# EAGLE schematic TiLDA Mk2 Prototype v0.1 (EAGLE 6.1)
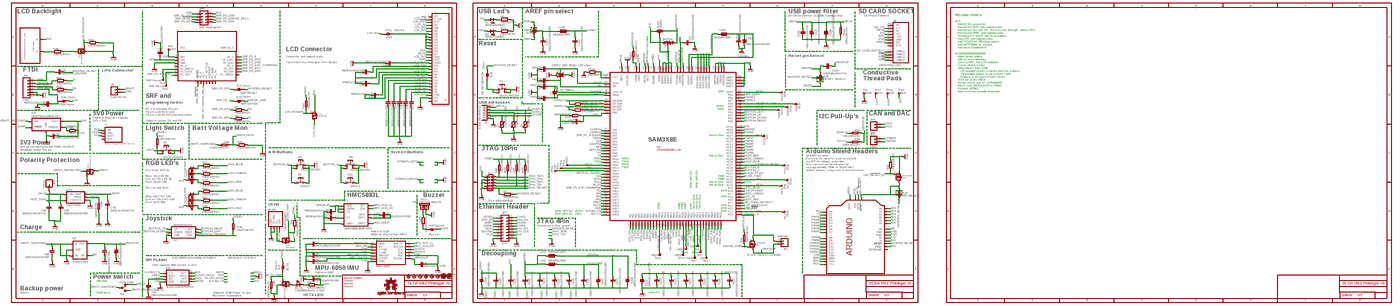
[diagram p0: schematic, sheet 1, overview]
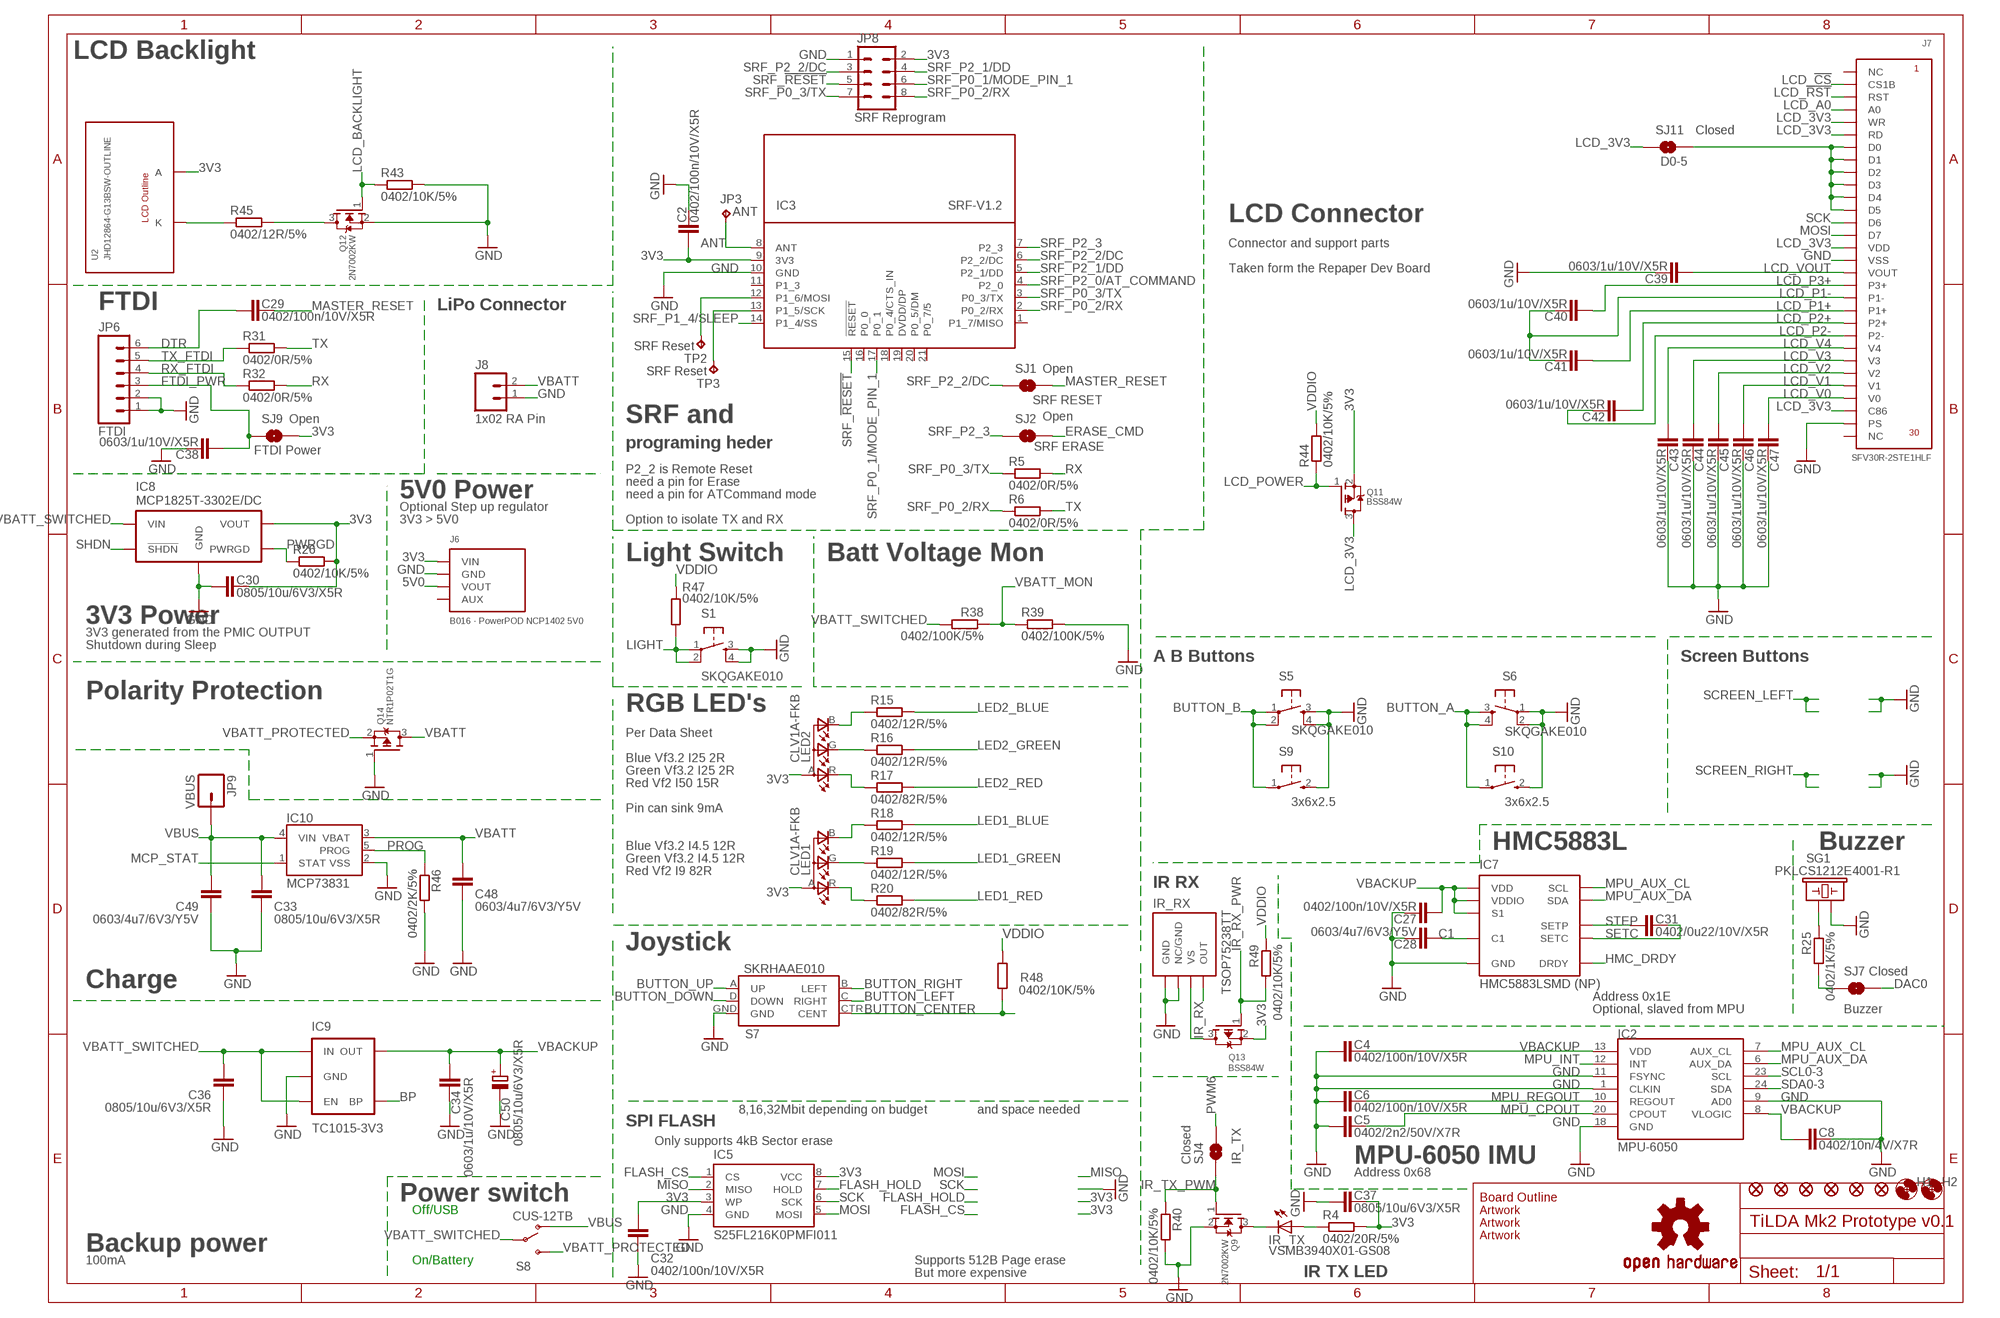
[diagram p1: schematic, sheet 1, part 1 of 4]
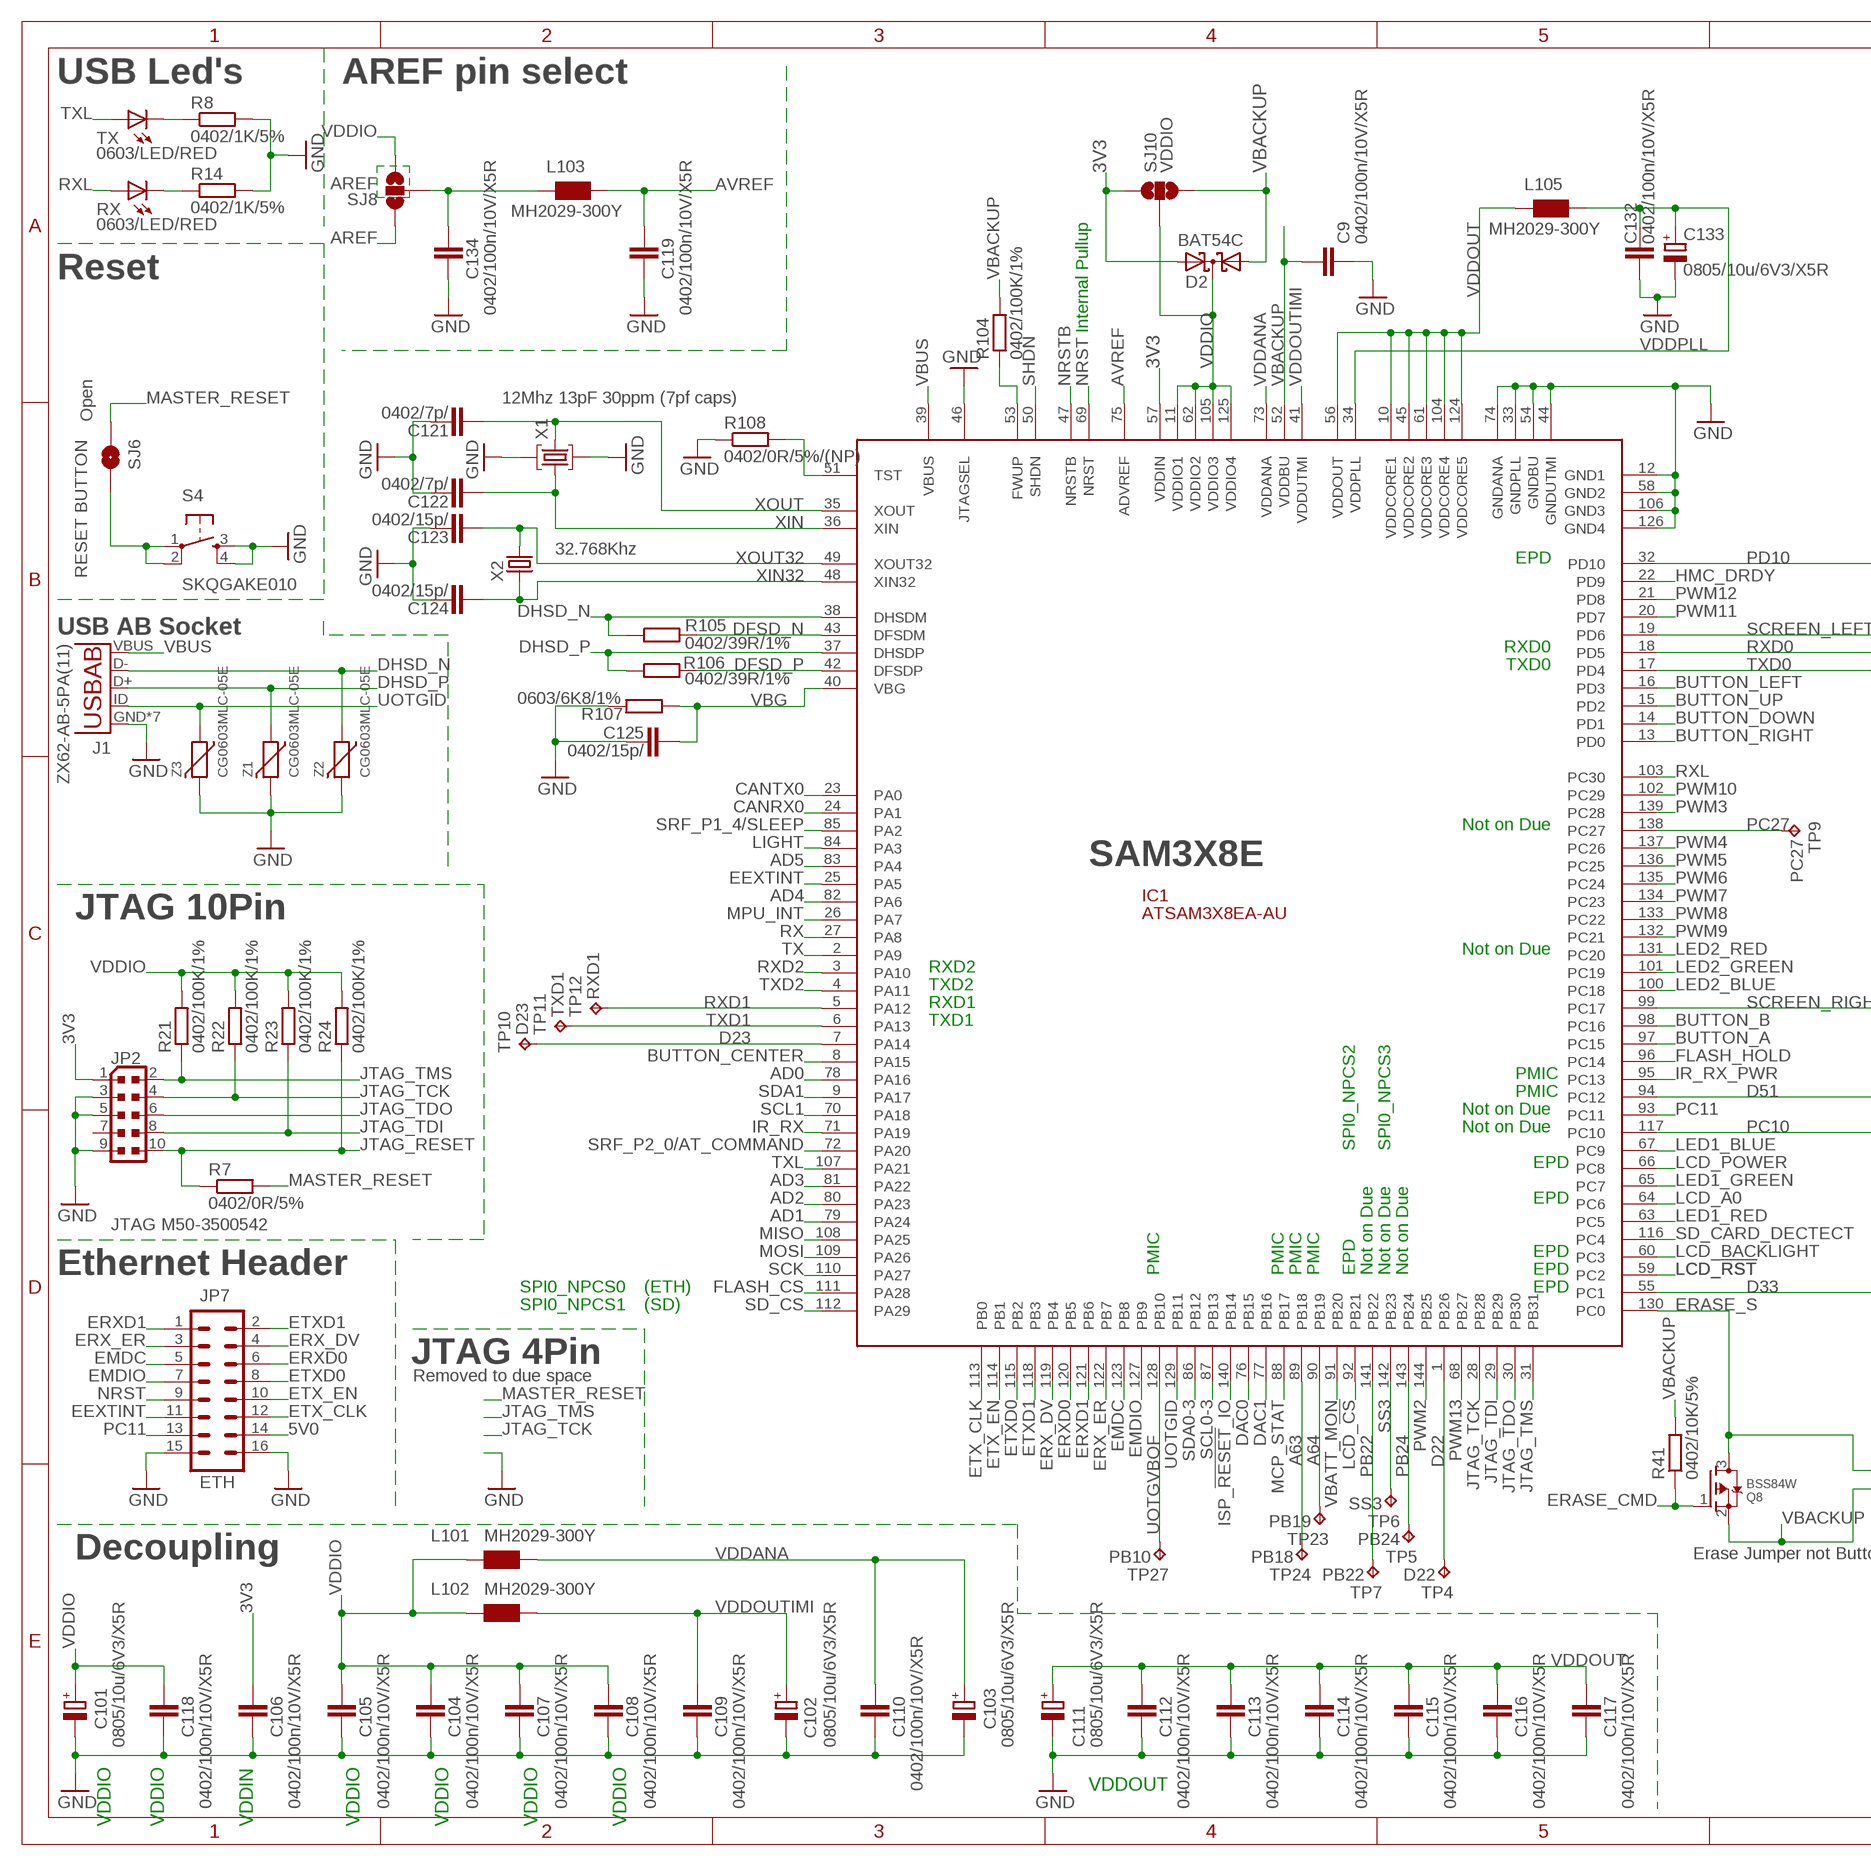
[diagram p2: schematic, sheet 1, part 2 of 4]
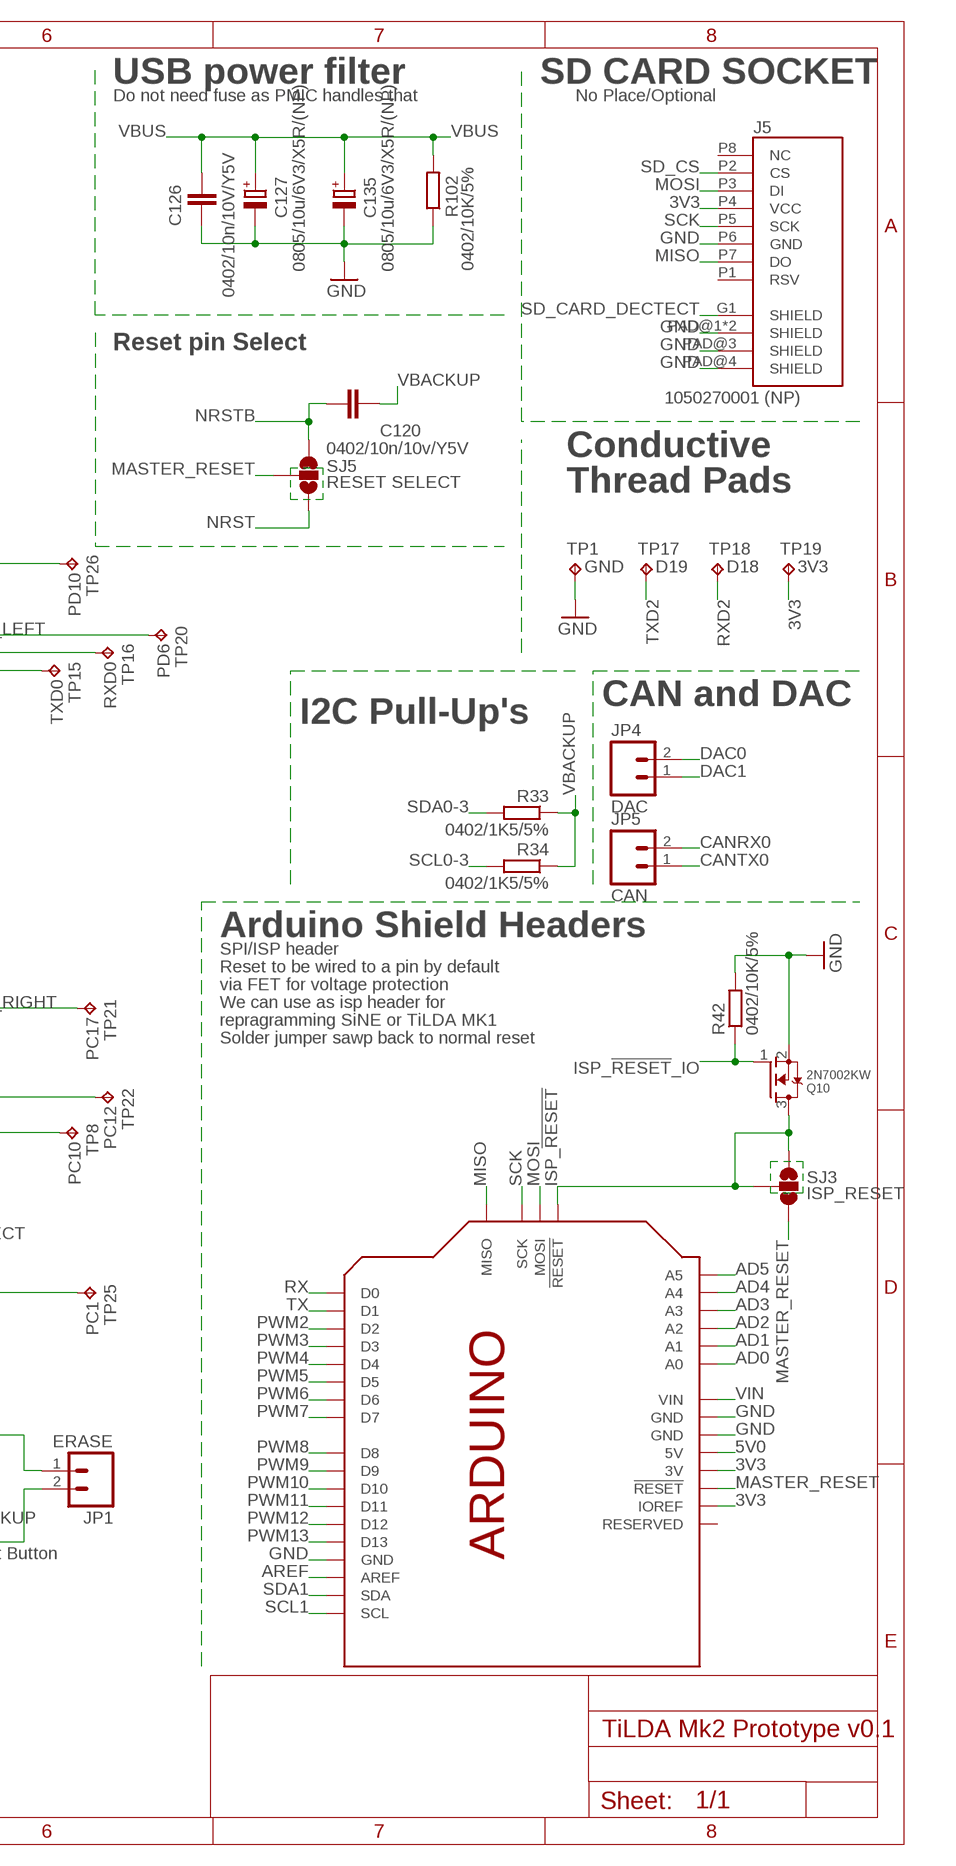
[diagram p3: schematic, sheet 1, part 3 of 4]
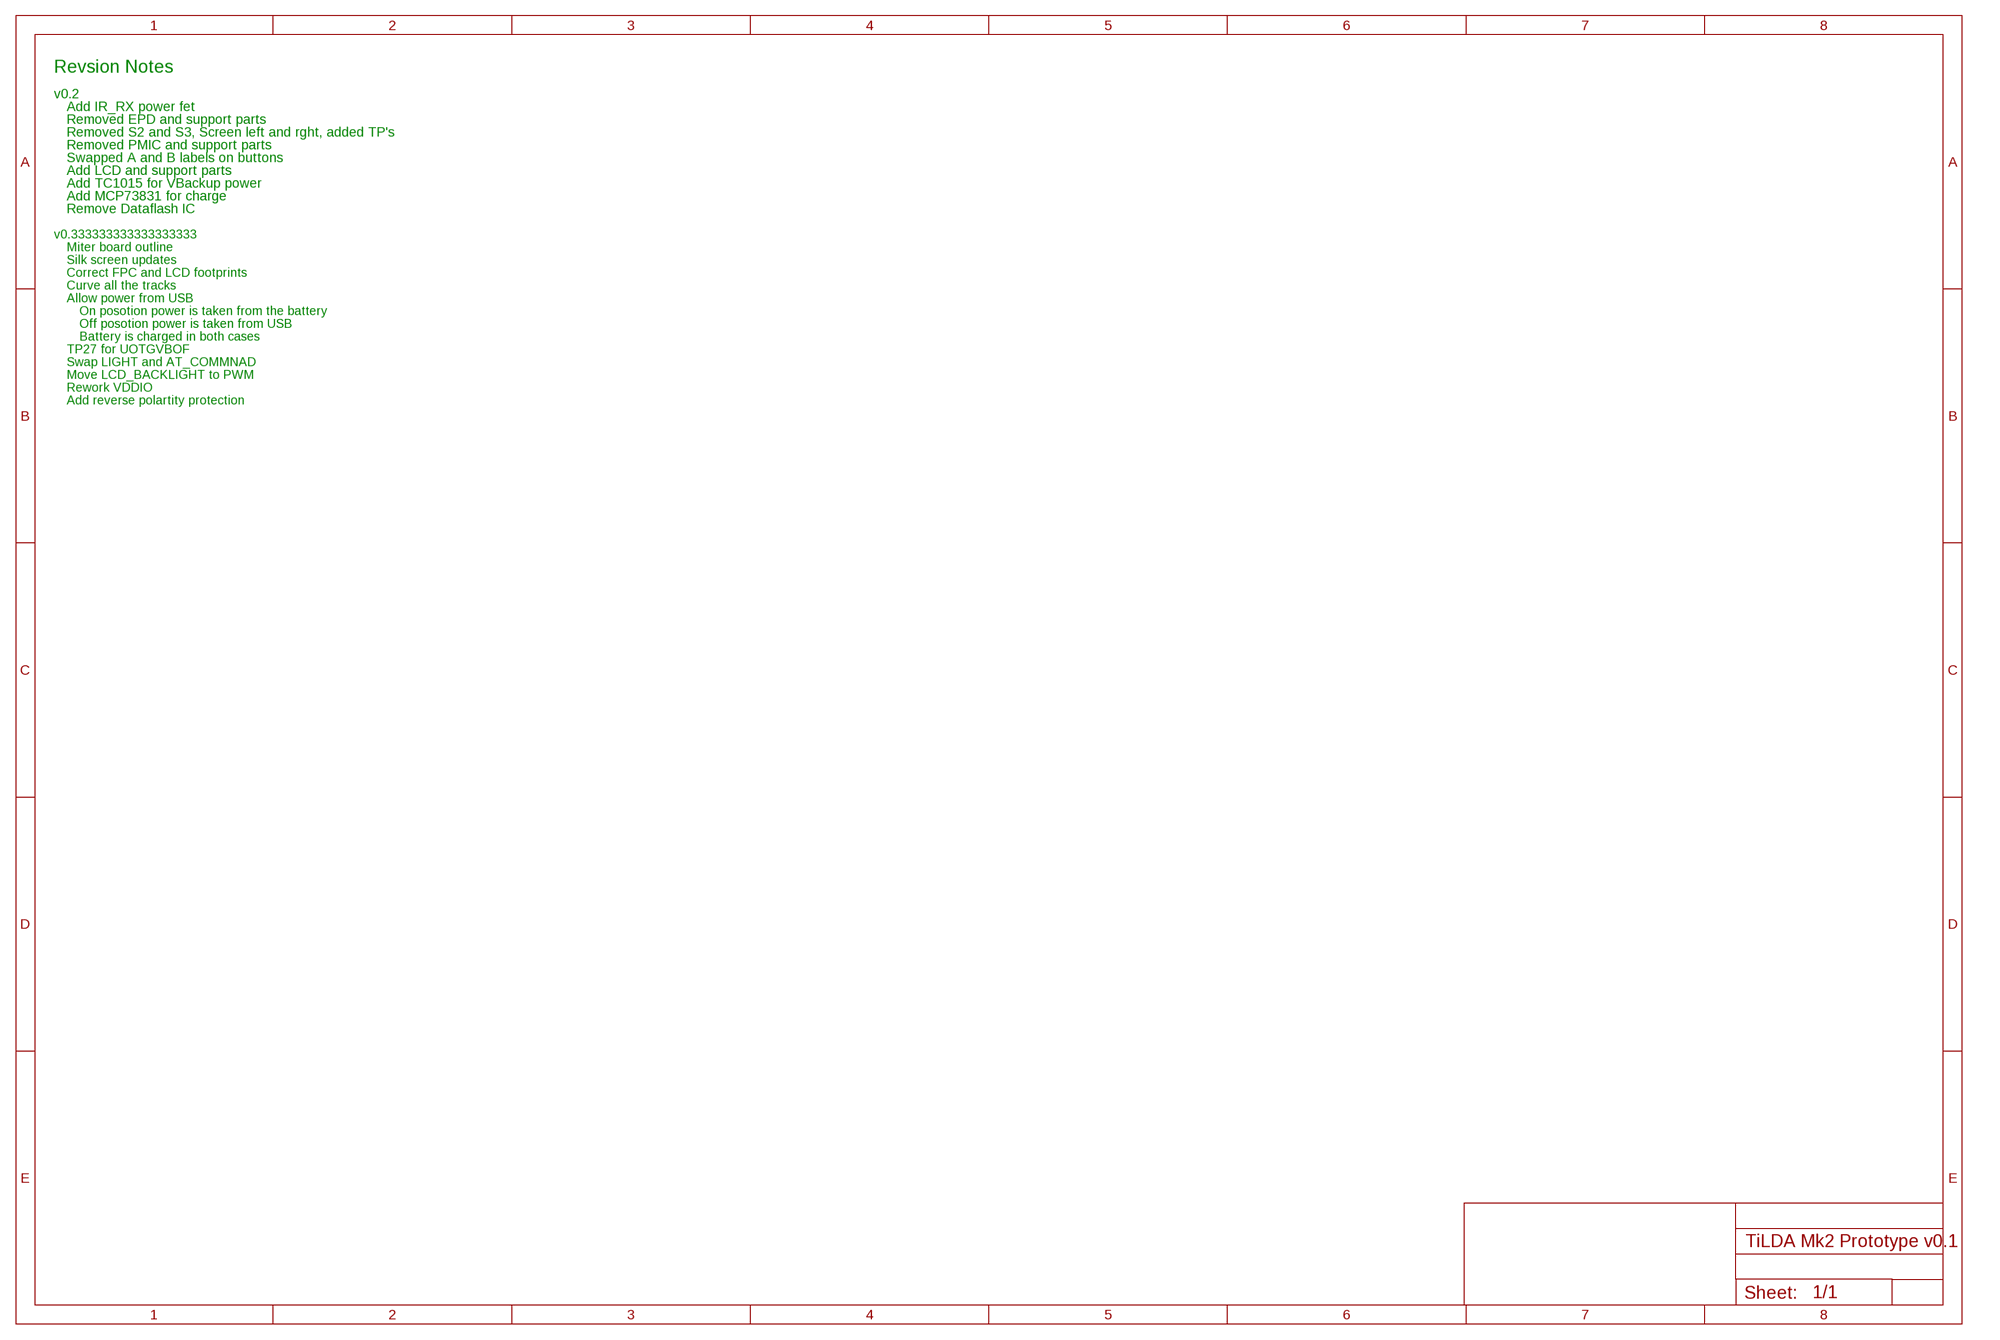
[diagram p4: schematic, sheet 1, part 4 of 4]

## Parts
ARTWORK1  ARTWORK_FRONT1  [TILDA_ARTWORK_FRONT1]
ARTWORK2  ARTWORK_ACHIEVEMENT2  [TILDA_ARTWORK_ACHIEVEMENT2]
ARTWORK3  ARTWORK_ACHIEVEMENT3  [TILDA_ARTWORK_ACHIEVEMENT3]
C2  0402/100n/10V/X5R  C-EUC0402-ARDUINO-ROUND  [C0402-ARDUINO-ROUND]
C4  0402/100n/10V/X5R  C-EUC0402-ARDUINO-ROUND  [C0402-ARDUINO-ROUND]
C5  0402/2n2/50V/X7R  C-EUC0402-ARDUINO-ROUND  [C0402-ARDUINO-ROUND]
C6  0402/100n/10V/X5R  C-EUC0402-ARDUINO-ROUND  [C0402-ARDUINO-ROUND]
C8  0402/10n/4V/X7R  C-EUC0402-ARDUINO-ROUND  [C0402-ARDUINO-ROUND]
C9  0402/100n/10V/X5R  C-EUC0402-ARDUINO-ROUND  [C0402-ARDUINO-ROUND]
C27  0402/100n/10V/X5R  C-EUC0402-ARDUINO-ROUND  [C0402-ARDUINO-ROUND]
C28  0603/4u7/6V3/Y5V  C-EUC0603-ROUND  [C0603-ROUND]
C29  0402/100n/10V/X5R  C-EUC0402-ARDUINO-ROUND  [C0402-ARDUINO-ROUND]
C30  0805/10u/6V3/X5R  C-EUC0805RND  [C0805RND]
C31  0402/0u22/10V/X5R  C-EUC0402-ARDUINO-ROUND  [C0402-ARDUINO-ROUND]
C32  0402/100n/10V/X5R  C-EUC0402-ARDUINO-ROUND  [C0402-ARDUINO-ROUND]
C33  0805/10u/6V3/X5R  C-EUC0805RND  [C0805RND]
C34  0603/1u/10V/X5R  C-EUC0603-ROUND  [C0603-ROUND]
C36  0805/10u/6V3/X5R  C-EUC0805RND  [C0805RND]
C37  0805/10u/6V3/X5R  C-EUC0805RND  [C0805RND]
C38  0603/1u/10V/X5R  C-EUC0603-ROUND  [C0603-ROUND]
C39  0603/1u/10V/X5R  C-EUC0603-ROUND  [C0603-ROUND]
C40  0603/1u/10V/X5R  C-EUC0603-ROUND  [C0603-ROUND]
C41  0603/1u/10V/X5R  C-EUC0603-ROUND  [C0603-ROUND]
C42  0603/1u/10V/X5R  C-EUC0603-ROUND  [C0603-ROUND]
C43  0603/1u/10V/X5R  C-EUC0603-ROUND  [C0603-ROUND]
C44  0603/1u/10V/X5R  C-EUC0603-ROUND  [C0603-ROUND]
C45  0603/1u/10V/X5R  C-EUC0603-ROUND  [C0603-ROUND]
C46  0603/1u/10V/X5R  C-EUC0603-ROUND  [C0603-ROUND]
C47  0603/1u/10V/X5R  C-EUC0603-ROUND  [C0603-ROUND]
C48  0603/4u7/6V3/Y5V  C-EUC0603-ROUND  [C0603-ROUND]
C49  0603/4u7/6V3/Y5V  C-EUC0603-ROUND  [C0603-ROUND]
C50  0805/10u/6V3/X5R  CPOL-EU-C0805RNDPOL  [C0805RNDPOL]
C101  0805/10u/6V3/X5R  CPOL-EU-C0805RNDPOL  [C0805RNDPOL]
C102  0805/10u/6V3/X5R  CPOL-EU-C0805RNDPOL  [C0805RNDPOL]
C103  0805/10u/6V3/X5R  CPOL-EU-C0805RNDPOL  [C0805RNDPOL]
C104  0402/100n/10V/X5R  C-EUC0402-ARDUINO-ROUND  [C0402-ARDUINO-ROUND]
C105  0402/100n/10V/X5R  C-EUC0402-ARDUINO-ROUND  [C0402-ARDUINO-ROUND]
C106  0402/100n/10V/X5R  C-EUC0402-ARDUINO-ROUND  [C0402-ARDUINO-ROUND]
C107  0402/100n/10V/X5R  C-EUC0402-ARDUINO-ROUND  [C0402-ARDUINO-ROUND]
C108  0402/100n/10V/X5R  C-EUC0402-ARDUINO-ROUND  [C0402-ARDUINO-ROUND]
C109  0402/100n/10V/X5R  C-EUC0402-ARDUINO-ROUND  [C0402-ARDUINO-ROUND]
C110  0402/100n/10V/X5R  C-EUC0402-ARDUINO-ROUND  [C0402-ARDUINO-ROUND]
C111  0805/10u/6V3/X5R  CPOL-EU-C0805RNDPOL  [C0805RNDPOL]
C112  0402/100n/10V/X5R  C-EUC0402-ARDUINO-ROUND  [C0402-ARDUINO-ROUND]
C113  0402/100n/10V/X5R  C-EUC0402-ARDUINO-ROUND  [C0402-ARDUINO-ROUND]
C114  0402/100n/10V/X5R  C-EUC0402-ARDUINO-ROUND  [C0402-ARDUINO-ROUND]
C115  0402/100n/10V/X5R  C-EUC0402-ARDUINO-ROUND  [C0402-ARDUINO-ROUND]
C116  0402/100n/10V/X5R  C-EUC0402-ARDUINO-ROUND  [C0402-ARDUINO-ROUND]
C117  0402/100n/10V/X5R  C-EUC0402-ARDUINO-ROUND  [C0402-ARDUINO-ROUND]
C118  0402/100n/10V/X5R  C-EUC0402-ARDUINO-ROUND  [C0402-ARDUINO-ROUND]
C119  0402/100n/10V/X5R  C-EUC0402-ARDUINO-ROUND  [C0402-ARDUINO-ROUND]
C120  0402/10n/10v/Y5V  C-EUC0402-ARDUINO-ROUND  [C0402-ARDUINO-ROUND]
C121  0402/7p/  C-EUC0402-ARDUINO-ROUND  [C0402-ARDUINO-ROUND]
C122  0402/7p/  C-EUC0402-ARDUINO-ROUND  [C0402-ARDUINO-ROUND]
C123  0402/15p/  C-EUC0402-ARDUINO-ROUND  [C0402-ARDUINO-ROUND]
C124  0402/15p/  C-EUC0402-ARDUINO-ROUND  [C0402-ARDUINO-ROUND]
C125  0402/15p/  C-EUC0402-ARDUINO-ROUND  [C0402-ARDUINO-ROUND]
C126  0402/10n/10V/Y5V  C-EUC0402-ARDUINO-ROUND  [C0402-ARDUINO-ROUND]
C127  0805/10u/6V3/X5R/(NP)  CPOL-EU-C0805RNDPOL  [C0805RNDPOL]
C132  0402/100n/10V/X5R  C-EUC0402-ARDUINO-ROUND  [C0402-ARDUINO-ROUND]
C133  0805/10u/6V3/X5R  CPOL-EU-C0805RNDPOL  [C0805RNDPOL]
C134  0402/100n/10V/X5R  C-EUC0402-ARDUINO-ROUND  [C0402-ARDUINO-ROUND]
C135  0805/10u/6V3/X5R/(NP)  CPOL-EU-C0805RNDPOL  [C0805RNDPOL]
D2  BAT54C  [SOT23]
FID1  FIDUCIAL1X2.5-STOP  [FIDUCIAL-1X2.5-STOP]
FID2  FIDUCIAL1X2.5-STOP  [FIDUCIAL-1X2.5-STOP]
FID3  FIDUCIAL1X2.5-STOP  [FIDUCIAL-1X2.5-STOP]
FID4  FIDUCIAL1X2.5-STOP  [FIDUCIAL-1X2.5-STOP]
FID5  FIDUCIAL1X2.5-STOP  [FIDUCIAL-1X2.5-STOP]
FID6  FIDUCIAL1X2.5-STOP  [FIDUCIAL-1X2.5-STOP]
H1  MOUNT-HOLE4.5-LWK  [4,5-LWK]
H2  MOUNT-HOLE4.5-LWK  [4,5-LWK]
IC1  ATSAM3X8EA-AU  ATSAM3X/AAU  [LQFP144]
IC2  MPU-6050  [QFN-24-NODIE]
IC3  SRF-V1.2  SRF-LANDING-1.2  [SRF-LANDING-1.2]
IC5  S25FL216K0PMFI011  SPI_FLASH-X25XXSMD1  [SO08-EIAJ]
IC7  HMC5883LSMD (NP)  HMC5883LSMD  [16LPCC]
IC8  MCP1825T-3302E/DC  [SOT127P700X180-6N]
IC9  TC1015-3V3  V_REG_LDOSMD  [SOT23-5]
IC10  MCP73831  [SOT23-5]
IR_RX  TSOP75238TT  IR-RECEIVERTSOP75438TT  [TSOP75X]
IR_TX  VSMB3940X01-GS08  IR-SENDER-PLCC  [P-LCC-2]
J1  ZX62-AB-5PA(11)  USB-AB-LWK  [USB-AB-MICRO-SMD_LWK]
J3  Arduino Headers  ARDUINOSPI-REFRENCE  [ARDUINOR3-LWKTXT-REF-SPI]
J5  1050270001 (NP)  USD-SOCKET-105027-LWK  [105027-LWK]
J6  B016 - PowerPOD NCP1402 5V0  POWER-POD-EMF  [POWER-POD-EMF]
J7  SFV30R-2STE1HLF  JHD12863-G13BSW-CONNECTOR-SFV30R-2STE1HLF  [SFV30R-2STE1HLF]
J8  1x02 RA Pin  M02RA  [1X02_RA]
JP1  ERASE  M02PTH  [1X02]
JP2  JTAG M50-3500542  PINHEAD_PINHD-2X5PASSO127  [PINHEAD_2X05_127]
JP3  ANT  TPPAD1-13  [P1-13]
JP4  DAC  M021X02_NO_SILK_OCT  [1X02_NO_SILK_OCT]
JP5  CAN  M021X02_NO_SILK_OCT  [1X02_NO_SILK_OCT]
JP6  FTDI  M06SIP  [1X06]
JP7  ETH  M08X2  [2X8]
JP8  SRF Reprogram  M04X2-PAD  [2X4-PAD]
JP9  VBUS  M01PTH  [1X01]
L101  MH2029-300Y  WE-CBF_0805  [WUERTH-0805]
L102  MH2029-300Y  WE-CBF_0805  [WUERTH-0805]
L103  MH2029-300Y  WE-CBF_0805  [WUERTH-0805]
L105  MH2029-300Y  WE-CBF_0805  [WUERTH-0805]
LED1  CLV1A-FKB  LED-RGB_CLV1A-FKB  [LED-RGB_CLV1A-FKB]
LED2  CLV1A-FKB  LED-RGB_CLV1A-FKB  [LED-RGB_CLV1A-FKB]
LOGO1  OSHW-LOGOM  [OSHW-LOGO-M]
OUTLINE1  TILDA_BOARDOUTLINE-MITER  [TILDA_BADGEBOARDBARE-VERYWIDE-MITER]
Q8  BSS84W  MOSFET-P-SC70-3  [SC70-3-R]
Q9  2N7002KW  MOSFET-NSC70-3  [SC70-3-R]
Q10  2N7002KW  MOSFET-NSC70-3  [SC70-3-R]
Q11  BSS84W  MOSFET-P-SC70-3  [SC70-3-R]
Q12  2N7002KW  MOSFET-NSC70-3  [SC70-3-R]
Q13  BSS84W  MOSFET-P-SC70-3  [SC70-3-R]
Q14  NTR1P02T1G  MOSFET-P-SOT23  [SOT23-R]
R4  0402/20R/5%  R-EU_R0402-ARDUINO-ROUND  [R0402-ARDUINO-ROUND]
R5  0402/0R/5%  R-EU_R0402-ARDUINO-ROUND  [R0402-ARDUINO-ROUND]
R6  0402/0R/5%  R-EU_R0402-ARDUINO-ROUND  [R0402-ARDUINO-ROUND]
R7  0402/0R/5%  R-EU_R0402-ARDUINO-ROUND  [R0402-ARDUINO-ROUND]
R8  0402/1K/5%  R-EU_R0402-ARDUINO-ROUND  [R0402-ARDUINO-ROUND]
R14  0402/1K/5%  R-EU_R0402-ARDUINO-ROUND  [R0402-ARDUINO-ROUND]
R15  0402/12R/5%  R-EU_R0402-ARDUINO-ROUND  [R0402-ARDUINO-ROUND]
R16  0402/12R/5%  R-EU_R0402-ARDUINO-ROUND  [R0402-ARDUINO-ROUND]
R17  0402/82R/5%  R-EU_R0402-ARDUINO-ROUND  [R0402-ARDUINO-ROUND]
R18  0402/12R/5%  R-EU_R0402-ARDUINO-ROUND  [R0402-ARDUINO-ROUND]
R19  0402/12R/5%  R-EU_R0402-ARDUINO-ROUND  [R0402-ARDUINO-ROUND]
R20  0402/82R/5%  R-EU_R0402-ARDUINO-ROUND  [R0402-ARDUINO-ROUND]
R21  0402/100K/1%  R-EU_R0402-ARDUINO-ROUND  [R0402-ARDUINO-ROUND]
R22  0402/100K/1%  R-EU_R0402-ARDUINO-ROUND  [R0402-ARDUINO-ROUND]
R23  0402/100K/1%  R-EU_R0402-ARDUINO-ROUND  [R0402-ARDUINO-ROUND]
R24  0402/100K/1%  R-EU_R0402-ARDUINO-ROUND  [R0402-ARDUINO-ROUND]
R25  0402/1K/5%  R-EU_R0402-ARDUINO-ROUND  [R0402-ARDUINO-ROUND]
R26  0402/10K/5%  R-EU_R0402-ARDUINO-ROUND  [R0402-ARDUINO-ROUND]
R31  0402/0R/5%  R-EU_R0402-ARDUINO-ROUND  [R0402-ARDUINO-ROUND]
R32  0402/0R/5%  R-EU_R0402-ARDUINO-ROUND  [R0402-ARDUINO-ROUND]
R33  0402/1K5/5%  R-EU_R0402-ARDUINO-ROUND  [R0402-ARDUINO-ROUND]
R34  0402/1K5/5%  R-EU_R0402-ARDUINO-ROUND  [R0402-ARDUINO-ROUND]
R38  0402/100K/5%  R-EU_R0402-ARDUINO-ROUND  [R0402-ARDUINO-ROUND]
R39  0402/100K/5%  R-EU_R0402-ARDUINO-ROUND  [R0402-ARDUINO-ROUND]
R40  0402/10K/5%  R-EU_R0402-ARDUINO-ROUND  [R0402-ARDUINO-ROUND]
R41  0402/10K/5%  R-EU_R0402-ARDUINO-ROUND  [R0402-ARDUINO-ROUND]
R42  0402/10K/5%  R-EU_R0402-ARDUINO-ROUND  [R0402-ARDUINO-ROUND]
R43  0402/10K/5%  R-EU_R0402-ARDUINO-ROUND  [R0402-ARDUINO-ROUND]
R44  0402/10K/5%  R-EU_R0402-ARDUINO-ROUND  [R0402-ARDUINO-ROUND]
R45  0402/12R/5%  R-EU_R0402-ARDUINO-ROUND  [R0402-ARDUINO-ROUND]
R46  0402/2K/5%  R-EU_R0402-ARDUINO-ROUND  [R0402-ARDUINO-ROUND]
R47  0402/10K/5%  R-EU_R0402-ARDUINO-ROUND  [R0402-ARDUINO-ROUND]
R48  0402/10K/5%  R-EU_R0402-ARDUINO-ROUND  [R0402-ARDUINO-ROUND]
R49  0402/10K/5%  R-EU_R0402-ARDUINO-ROUND  [R0402-ARDUINO-ROUND]
R102  0402/10K/5%  R-EU_R0402-ARDUINO-ROUND  [R0402-ARDUINO-ROUND]
R104  0402/100K/1%  R-EU_R0402-ARDUINO-ROUND  [R0402-ARDUINO-ROUND]
R105  0402/39R/1%  R-EU_R0402-ARDUINO-ROUND  [R0402-ARDUINO-ROUND]
R106  0402/39R/1%  R-EU_R0402-ARDUINO-ROUND  [R0402-ARDUINO-ROUND]
R107  0603/6K8/1%  R-EU_R0603-ROUND  [R0603-ROUND]
R108  0402/0R/5%/(NP)  R-EU_R0402-ARDUINO-ROUND  [R0402-ARDUINO-ROUND]
RX  0603/LED/RED  LED0805-CORRECT  [LED-0805-CORRECT]
S1  SKQGAKE010  TAC_SWITCHSMD  [TACTILE_SWITCH_SMD]
S4  SKQGAKE010  TAC_SWITCHSMD  [TACTILE_SWITCH_SMD]
S5  SKQGAKE010  TAC_SWITCHSMD  [TACTILE_SWITCH_SMD]
S6  SKQGAKE010  TAC_SWITCHSMD  [TACTILE_SWITCH_SMD]
S7  SKRHAAE010  JOYSTICK_MINI_MULTICOMP  [JOYSTICK_MULTICOMP]
S8  CUS-12TB  SWITCH-SPST-SMD-A  [SWITCH-SPST-SMD-A]
S9  3x6x2.5  TAC_SWITCH1-3X6X2.5  [TACTILE_SWITCH_SMD_3X6X2.5H]
S10  3x6x2.5  TAC_SWITCH1-3X6X2.5  [TACTILE_SWITCH_SMD_3X6X2.5H]
SG1  PKLCS1212E4001-R1  BUZZER-PKLCS1212E  [BUZZER-PKLCS1212E]
SJ1  SRF RESET  SOLDERJUMPERNO  [SJ_2S-NO]
SJ2  SRF ERASE  SOLDERJUMPERNO  [SJ_2S-NO]
SJ3  ISP_RESET  SOLDERJUMPER_2WAYS  [SJ_3]
SJ4  IR_TX  SOLDERJUMPERTRACE  [SJ_2S-TRACE]
SJ5  RESET SELECT  SOLDERJUMPER_2WAYS  [SJ_3]
SJ6  RESET BUTTON  SOLDERJUMPERNO  [SJ_2S-NO]
SJ7  Buzzer  SOLDERJUMPERTRACE  [SJ_2S-TRACE]
SJ8  AREF  SOLDERJUMPER_2WAYS  [SJ_3]
SJ9  FTDI Power  SOLDERJUMPERNO  [SJ_2S-NO]
SJ10  VDDIO  SOLDERJUMPER_2WAYS  [SJ_3]
SJ11  D0-5  SOLDERJUMPERNO  [SJ_2S-NO]
TP1  GND  TPPAD1-13  [P1-13]
TP2  SRF Reset  TPB1,27  [B1,27]
TP3  SRF Reset  TPB1,27  [B1,27]
TP4  D22  TPB1,27  [B1,27]
TP5  PB24  TPB1,27  [B1,27]
TP6  SS3  TPB1,27  [B1,27]
TP7  PB22  TPB1,27  [B1,27]
TP8  PC10  TPB1,27  [B1,27]
TP9  PC27  TPB1,27  [B1,27]
TP10  D23  TPB1,27  [B1,27]
TP11  TXD1  TPB1,27  [B1,27]
TP12  RXD1  TPB1,27  [B1,27]
TP15  TXD0  TPB1,27  [B1,27]
TP16  RXD0  TPB1,27  [B1,27]
TP17  D19  TPPAD1-13  [P1-13]
TP18  D18  TPPAD1-13  [P1-13]
TP19  3V3  TPPAD1-13  [P1-13]
TP20  PD6  TPB1,27  [B1,27]
TP21  PC17  TPB1,27  [B1,27]
TP22  PC12  TPB1,27  [B1,27]
TP23  PB19  TPB1,27  [B1,27]
TP24  PB18  TPB1,27  [B1,27]
TP25  PC1  TPB1,27  [B1,27]
TP26  PD10  TPB1,27  [B1,27]
TP27  PB10  TPB1,27  [B1,27]
TX  0603/LED/RED  LED0805-CORRECT  [LED-0805-CORRECT]
U2  JHD12864-G13BSW-OUTLINE  [JHD12864-G13BSW-OUTLINE]
X1  12Mhz 13pF 30ppm (7pf caps)  CRYSTAL-5X3.2  [CRYSTAL-5X3.2]
X2  32.768Khz  RESONATOR_EPSON_FC_145  [RESONATOR_EPSON_FC_145]
Z1  CG0603MLC-05E  VARISTORCN0603  [CT/CN0603]
Z2  CG0603MLC-05E  VARISTORCN0603  [CT/CN0603]
Z3  CG0603MLC-05E  VARISTORCN0603  [CT/CN0603]

## Nets
3V3: C2.2 C30.1 C32.2 C37.1 C106.2 D2.2(A2) IC1.57(VDDIN) IC3.9(3V3) IC5.3(WP) IC5.8(VCC) IC8.4(VOUT) J3.3V J3.IOREF J5.P4(VCC) J6.1(VIN) JP2.1 JP8.2 LED1.A(ANODE) LED2.A(ANODE) Q11.2(S) Q13.2(S) R4.2 R26.2 SJ9.2 SJ10.1 TP19.TP U2.A
5V0: J3.5V J3.5V@ISP(5V) J6.3(VOUT) JP7.14
A63: IC1.89(PB18) TP24.TP
A64: IC1.90(PB19) TP23.TP
AD0: IC1.78(PA16) J3.A0
AD1: IC1.79(PA24) J3.A1
AD2: IC1.80(PA23) J3.A2
AD3: IC1.81(PA22) J3.A3
AD4: IC1.82(PA6) J3.A4
AD5: IC1.83(PA4) J3.A5
ANT [ANT]: IC3.8(ANT) JP3.TP
AREF: J3.AREF SJ8.1
AVREF: C119.2 IC1.75(ADVREF) L103.2
BP: IC9.4(BP)
BUTTON_A: IC1.97(PC15) S6.3 S6.4 S10.1
BUTTON_B: IC1.98(PC16) S5.1 S5.2 S9.1
BUTTON_CENTER: IC1.8(PA15) R48.1 S7.CTR(CENT)
BUTTON_DOWN: IC1.14(PD1) S7.D(DOWN)
BUTTON_LEFT: IC1.16(PD3) S7.C(RIGHT)
BUTTON_RESET: S4.1 S4.2 SJ6.2
BUTTON_RIGHT: IC1.13(PD0) S7.B(LEFT)
BUTTON_UP: IC1.15(PD2) S7.A(UP)
BUZZER+: R25.1 SG1.P$1
BUZZER_RES: R25.2 SJ7.1
C1: C28.2 IC7.10(C1)
CANRX0: IC1.24(PA1) JP5.2
CANTX0: IC1.23(PA0) JP5.1
D22: IC1.1(PB26) TP4.TP
D23: IC1.7(PA14) TP10.TP
D33: IC1.55(PC1) TP25.TP
D51: IC1.94(PC12) TP22.TP
DAC0: IC1.76(PB15) JP4.2 SJ7.2
DAC1: IC1.77(PB16) JP4.1
DFSD_N [USB]: IC1.43(DFSDM) R105.2
DFSD_P [USB]: IC1.42(DFSDP) R106.2
DHSD_N [USB]: IC1.38(DHSDM) J1.D- R105.1 Z2.1
DHSD_P [USB]: IC1.37(DHSDP) J1.D+ R106.1 Z1.1
DTR: C29.2 JP6.6
EEXTINT: IC1.25(PA5) JP7.11
EMDC: IC1.123(PB8) JP7.5
EMDIO: IC1.127(PB9) JP7.7
ERASE_CMD: Q8.1(G) R41.1 SJ2.2
ERASE_S: IC1.130(PC0) JP1.1 Q8.3(D)
ERX_DV: IC1.119(PB4) JP7.4
ERX_ER: IC1.122(PB7) JP7.3
ERXD0: IC1.120(PB5) JP7.6
ERXD1: IC1.121(PB6) JP7.1
ETX_CLK: IC1.113(PB0) JP7.12
ETX_EN: IC1.114(PB1) JP7.10
ETXD0: IC1.115(PB2) JP7.8
ETXD1: IC1.118(PB3) JP7.2
FLASH_CS: IC1.111(PA28) IC5.1(CS)
FLASH_HOLD: IC1.96(PC14) IC5.7(HOLD)
FTDI_PWR: C38.2 JP6.3 SJ9.1
FWUP: IC1.53(FWUP) R104.1
GND: C2.1 C4.2 C5.2 C6.2 C8.1 C9.1 C27.1 C28.1 C30.2 C32.1 C33.1 C34.1 C36.1 C37.2 C38.1 C39.1 C43.1 C44.1 C45.1 C46.1 C47.1 C48.1 C49.1 C50.- C101.- C102.- C103.- C104.1 C105.1 C106.1 C107.1 C108.1 C109.1 C110.1 C111.- C112.1 C113.1 C114.1 C115.1 C116.1 C117.1 C118.1 C119.1 C121.1 C122.1 C123.1 C124.1 C125.1 C126.2 C127.- C132.2 C133.- C134.1 C135.- IC1.12(GND1) IC1.33(GNDPLL) IC1.44(GNDUTMI) IC1.46(JTAGSEL) IC1.54(GNDBU) IC1.58(GND2) IC1.74(GNDANA) IC1.106(GND3) IC1.126(GND4) IC2.1(CLKIN) IC2.9(AD0) IC2.11(FSYNC) IC2.18(GND) IC3.10(GND) IC5.4(GND) IC7.9(GND) IC7.11(GND) IC8.3(GND) IC8.6(GND) IC9.2(GND) IC10.2(VSS) IR_RX.1(GND) IR_RX.4(NC/GND) J1.GND J1.P$1(GND) J1.P$2(GND) J1.P$6(GND) J1.P$7(GND) J1.P$8(GND) J1.P$9(GND) J3.GND@1(GND) J3.GND@2(GND) J3.GND@3(GND) J3.GND@ISP(GND) J5.P6(GND) J5.PAD@1(SHIELD) J5.PAD@2(SHIELD) J5.PAD@3(SHIELD) J5.PAD@4(SHIELD) J6.2(GND) J7.16(VSS) J7.29(PS) J7.M1(VSS) J7.M2(VSS) J8.1 JP2.3 JP2.5 JP2.9 JP6.1 JP6.2 JP7.15 JP7.16 JP8.1 Q9.2(S) Q10.2(S) Q12.2(S) Q14.1(G) R8.2 R14.2 R39.2 R40.2 R42.2 R43.2 R46.2 R102.1 R107.2 R108.1 S1.3 S1.4 S4.3 S4.4 S5.3 S5.4 S6.1 S6.2 S7.GND S9.2 S10.2 SG1.P$2 TP1.TP X1.2(GND) X1.4(GND) Z1.2 Z2.2 Z3.2
HMC_DRDY: IC1.22(PD9) IC7.15(DRDY)
IR_RX: IC1.71(PA19) IR_RX.3(OUT)
IR_RX_PWR: IC1.95(PC13) Q13.1(G) R49.2
IR_TX_A: IR_TX.A R4.1
IR_TX_C: IR_TX.C Q9.3(D)
IR_TX_PWM: Q9.1(G) R40.1 SJ4.1
ISP_!RESET: J3.!RESET@ISP(!RESET) Q10.3(D) SJ3.1 SJ3.2
ISP_!RESET!_IO: IC1.140(PB14) Q10.1(G) R42.1
JTAG_RESET: JP2.10 R7.1 R24.1
JTAG_TCK: IC1.28(PB28) JP2.4 R22.1
JTAG_TDI: IC1.29(PB29) JP2.8 R23.1
JTAG_TDO: IC1.30(PB30) JP2.6
JTAG_TMS: IC1.31(PB31) JP2.2 R21.1
LCD_3V3: J7.5(WR) J7.6(RD) J7.15(VDD) J7.28(C86) Q11.3(D) SJ11.1
LCD_!CS: IC1.92(PB21) J7.2(CS1B)
LCD_!RST: IC1.59(PC2) J7.3(RST)
LCD_A0: IC1.64(PC6) J7.4(A0)
LCD_A_SWITCHED: Q12.3(D) R45.2
LCD_BACKLIGHT: IC1.60(PC3) Q12.1(G) R43.1
LCD_P1+: C41.2 J7.20(P1+)
LCD_P1-: C40.1 C41.1 J7.19(P1-)
LCD_P2+: C42.2 J7.21(P2+)
LCD_P2-: C42.1 J7.22(P2-)
LCD_P3+: C40.2 J7.18(P3+)
LCD_POWER: IC1.66(PC8) Q11.1(G) R44.1
LCD_V0: C47.2 J7.27(V0)
LCD_V1: C46.2 J7.26(V1)
LCD_V2: C45.2 J7.25(V2)
LCD_V3: C44.2 J7.24(V3)
LCD_V4: C43.2 J7.23(V4)
LCD_VOUT: C39.2 J7.17(VOUT)
LED1_BLUE: IC1.67(PC9) R18.2
LED1_GREEN: IC1.65(PC7) R19.2
LED1_RED: IC1.63(PC5) R20.2
LED2_BLUE: IC1.100(PC18) R15.2
LED2_GREEN: IC1.101(PC19) R16.2
LED2_RED: IC1.131(PC20) R17.2
LIGHT: IC1.84(PA3) R47.1 S1.1 S1.2
MASTER_RESET: C29.1 J3.!RESET R7.2 SJ1.2 SJ3.3 SJ5.2 SJ6.1
MCP_STAT: IC1.88(PB17) IC10.1(STAT)
MISO: IC1.108(PA25) IC5.2(MISO) J3.MISO J5.P7(DO)
MOSI: IC1.109(PA26) IC5.5(MOSI) J3.MOSI J5.P3(DI) J7.14(D7)
MPU_AUX_CL: IC2.7(AUX_CL) IC7.1(SCL)
MPU_AUX_DA: IC2.6(AUX_DA) IC7.16(SDA)
MPU_CPOUT: C5.1 IC2.20(CPOUT)
MPU_INT: IC1.26(PA7) IC2.12(INT)
MPU_REGOUT: C6.1 IC2.10(REGOUT)
N$1: R45.1 U2.K
N$2: R8.1 TX.C
N$3: R14.1 RX.C
N$5: J7.7(D0) J7.8(D1) J7.9(D2) J7.10(D3) J7.11(D4) J7.12(D5) SJ11.2
N$8: LED1.R(CRED) R20.1
N$9: LED1.G(CGREEN) R19.1
N$10: LED1.B(CBLUE) R18.1
N$14: LED2.R(CRED) R17.1
N$15: LED2.G(CGREEN) R16.1
N$16: C134.2 L103.1 SJ8.2
N$17: LED2.B(CBLUE) R15.1
N$20: IR_RX.2(VS) Q13.3(D)
N$23: IC3.12(P1_6/MOSI) TP2.TP
N$27: IC3.13(P1_5/SCK) TP3.TP
NRST: IC1.69(NRST) JP7.9 SJ5.3
NRSTB: C120.2 IC1.47(NRSTB) SJ5.1
PB22: IC1.141(PB22) TP7.TP
PB24: IC1.143(PB24) TP5.TP
PC10: IC1.117(PC10) TP8.TP
PC11: IC1.93(PC11) JP7.13
PC27: IC1.138(PC27) TP9.TP
PD10: IC1.32(PD10) TP26.TP
PROG: IC10.5(PROG) R46.1
PWM2: IC1.144(PB25) J3.D2
PWM3: IC1.139(PC28) J3.D3
PWM4: IC1.137(PC26) J3.D4
PWM5: IC1.136(PC25) J3.D5
PWM6: IC1.135(PC24) J3.D6 SJ4.2
PWM7: IC1.134(PC23) J3.D7
PWM8: IC1.133(PC22) J3.D8
PWM9: IC1.132(PC21) J3.D9
PWM10: IC1.102(PC29) J3.D10
PWM11: IC1.20(PD7) J3.D11
PWM12: IC1.21(PD8) J3.D12
PWM13: IC1.68(PB27) J3.D13
PWRGD: IC8.5(PWRGD) R26.1
RX: IC1.27(PA8) J3.D0 R5.2 R32.2
RX_FTDI: JP6.4 R32.1
RXD0: IC1.18(PD5) TP16.TP
RXD1: IC1.5(PA12) TP12.TP
RXD2: IC1.3(PA10) TP18.TP
RXL: IC1.103(PC30) RX.A
SCK: IC1.110(PA27) IC5.6(SCK) J3.SCK J5.P5(SCK) J7.13(D6)
SCL0-3: IC1.87(PB13) IC2.23(SCL) R34.2
SCL1: IC1.70(PA18) J3.SCL
SCREEN_LEFT: IC1.19(PD6) TP20.TP
SCREEN_RIGHT: IC1.99(PC17) TP21.TP
SD_CARD_DECTECT: IC1.116(PC4) J5.G1(SHIELD)
SD_CS: IC1.112(PA29) J5.P2(CS)
SDA0-3: IC1.86(PB12) IC2.24(SDA) R33.2
SDA1: IC1.9(PA17) J3.SDA
SETC: C31.1 IC7.12(SETC)
SHDN: IC1.50(SHDN) IC8.1(!SHDN)
SRF_!RESET: IC3.15(!RESET) JP8.5
SRF_P0_1/MODE_PIN_1: IC3.17(P0_1) JP8.6
SRF_P0_2/RX: IC3.2(P0_2/RX) JP8.8 R6.1
SRF_P0_3/TX: IC3.3(P0_3/TX) JP8.7 R5.1
SRF_P1_4/SLEEP: IC1.85(PA2) IC3.14(P1_4/SS)
SRF_P2_0/AT_COMMAND: IC1.72(PA20) IC3.4(P2_0)
SRF_P2_1/DD: IC3.5(P2_1/DD) JP8.4
SRF_P2_2/DC: IC3.6(P2_2/DC) JP8.3 SJ1.1
SRF_P2_3: IC3.7(P2_3) SJ2.1
SS3: IC1.142(PB23) TP6.TP
STEP: C31.2 IC7.8(SETP)
TST: IC1.51(TST) R108.2
TX: IC1.2(PA9) J3.D1 R6.2 R31.2
TX_FTDI: JP6.5 R31.1
TXD0: IC1.17(PD4) TP15.TP
TXD1: IC1.6(PA13) TP11.TP
TXD2: IC1.4(PA11) TP17.TP
TXL: IC1.107(PA21) TX.A
UOTGID: IC1.129(PB11) J1.ID(USBID) Z3.1
UOTGVBOF: IC1.128(PB10) TP27.TP
VBACKUP: C4.1 C8.2 C9.2 C27.2 C34.2 C50.+ C120.1 D2.1(A1) IC1.52(VDDBU) IC2.8(VLOGIC) IC2.13(VDD) IC7.2(VDD) IC7.4(S1) IC7.13(VDDIO) IC9.5(OUT) JP1.2 Q8.2(S) R33.1 R34.1 R41.2 R104.2 SJ10.3
VBATT: C48.2 IC10.3(VBAT) J8.2 Q14.3(D)
VBATT_MON: IC1.91(PB20) R38.1 R39.1
VBATT_PROTECTED: Q14.2(S) S8.3(S)
VBATT_SWITCHED: C36.2 IC8.2(VIN) IC9.1(IN) IC9.3(EN) R38.2 S8.2(P)
VBG: C125.2 IC1.40(VBG) R107.1
VBUS: C33.2 C49.2 C126.1 C127.+ C135.+ IC1.39(VBUS) IC10.4(VIN) J1.VBUS JP9.1 R102.2 S8.1(O)
VDDANA: C103.+ C110.2 IC1.73(VDDANA) L101.2
VDDIO: C101.+ C104.2 C105.2 C107.2 C108.2 C118.2 D2.3(CC) IC1.11(VDDIO1) IC1.62(VDDIO2) IC1.105(VDDIO3) IC1.125(VDDIO4) L101.1 L102.1 R21.2 R22.2 R23.2 R24.2 R44.2 R47.2 R48.2 R49.1 SJ8.3 SJ10.2
VDDOUT: C111.+ C112.2 C113.2 C114.2 C115.2 C116.2 C117.2 IC1.10(VDDCORE1) IC1.45(VDDCORE2) IC1.56(VDDOUT) IC1.61(VDDCORE3) IC1.104(VDDCORE4) IC1.124(VDDCORE5) L105.1
VDDOUTIMI: C102.+ C109.2 IC1.41(VDDUTMI) L102.2
VDDPLL: C132.1 C133.+ IC1.34(VDDPLL) L105.2
VIN: J3.VIN
XIN: C122.2 IC1.36(XIN) X1.1(C1)
XIN32: C124.2 IC1.48(XIN32) X2.P$1
XOUT: C121.2 IC1.35(XOUT) X1.3(C2)
XOUT32: C123.2 IC1.49(XOUT32) X2.P$2
Unconnected: IC3.1(P1_7/MISO) IC3.11(P1_3) IC3.16(P0_0) IC3.18(P0_4/CTS_IN) IC3.19(DVDD/DP) IC3.20(P0_5/DM) IC3.21(P0_7/5) J3.RESERVED J5.P1(RSV) J5.P8(NC) J6.4(AUX) J7.1(NC) J7.30(NC) JP2.7

## Notes on the sheet
- LCD Backlight | USB Led's | AREF pin select | USB power filter | SD CARD SOCKET
- Do not need fuse as PMIC handles that | No Place/Optional | Revsion Notes
- v0.2
- Add IR_RX power fet
- Removed EPD and support parts
- Closed | Removed S2 and S3, Screen left and rght, added TP's
- Removed PMIC and support parts
- Swapped A and B labels on buttons
- Add LCD and support parts
- Add TC1015 for VBackup power
- Reset | Add MCP73831 for charge
- Remove Dataflash IC
- LCD Connector
- Internal Pullup | v0.333333333333333333
- Connector and support parts | Reset pin Select | Miter board outline
- Silk screen updates
- Taken form the Repaper Dev Board | Correct FPC and LCD footprints
- Curve all the tracks
- Open | Allow power from USB
- FTDI | LiPo Connector | On posotion power is taken from the battery
- Conductive | Off posotion power is taken from USB
- Battery is charged in both cases
- Thread Pads | TP27 for UOTGVBOF
- Swap LIGHT and AT_COMMNAD
- Open | Move LCD_BACKLIGHT to PWM
- Rework VDDIO
- EPD | Add reverse polartity protection
- Open | SRF and | Open
- programing heder | USB AB Socket
- RXD0
- P2_2 is Remote Reset | TXD0
- need a pin for Erase
- 5V0 Power | need a pin for ATCommand mode | CAN and DAC
- Optional Step up regulator | I2C Pull-Up's
- 3V3 > 5V0 | Option to isolate TX and RX
- Light Switch | Batt Voltage Mon
- Not on Due
- SAM3X8E
- 3V3 Power
- 3V3 generated from the PMIC OUTPUT
- Shutdown during Sleep | JTAG 10Pin
- A B Buttons | Screen Buttons | Arduino Shield Headers
- Not on Due | SPI/ISP header
- RXD2 | Reset to be wired to a pin by default
- Polarity Protection | TXD2 | via FET for voltage protection
- RGB LED's | RXD1 | We can use as isp header for
- TXD1 | repragramming SiNE or TiLDA MK1
- Per Data Sheet | Solder jumper sawp back to normal reset
- Blue Vf3.2 I25 2R | PMIC
- Green Vf3.2 I25 2R | PMIC
- Red Vf2 I50 15R | Not on Due
- Not on Due
- Pin can sink 9mA | SPI0_NPCS2 | SPI0_NPCS3
- EPD
- Blue Vf3.2 I4.5 12R | HMC5883L | Buzzer | EPD
- Green Vf3.2 I4.5 12R
- Red Vf2 I9 82R
- IR RX | EPD
- Ethernet Header | PMIC | PMIC | PMIC | PMIC | EPD | Not on Due | Not on Due | Not on Due | EPD
- SPI0_NPCS0 | (ETH) | EPD
- SPI0_NPCS1 | (SD)
- Joystick
- JTAG 4Pin
- Closed | Removed to due space
- Charge
- Address 0x1E
- Optional, slaved from MPU
- Decoupling | Erase Jumper not Button
- 8,16,32Mbit depending on budget | and space needed
- SPI FLASH
- Only supports 4kB Sector erase
- Closed | MPU-6050 IMU
- Address 0x68
- Power switch
- Off/USB
- Backup power
- 100mA | On/Battery | Supports 512B Page erase | VDDOUT
- But more expensive | IR TX LED
- VDDIO | VDDIO | VDDIN | VDDIO | VDDIO | VDDIO | VDDIO

## Library data of the parts
ARTWORK1-ARTWORK3 = TiLDA Mk2 Parts:ARTWORK
C2 C4-C6 C8 C9 C27-C34 C36-C49 C104-C110 C112-C126 C132 C134 = TiLDA Mk2 Parts:C-EU: CAPACITOR, European symbol
C50 C101-C103 C111 C127 C133 C135 = TiLDA Mk2 Parts:CPOL-EU: POLARIZED CAPACITOR, European symbol
D2 = TiLDA Mk2 Parts:BAT54C: Schottky Diodes Source: Fairchild .. BAT54.pdf
FID1-FID6 = TiLDA Mk2 Parts:FIDUCIAL: Fiducial Alignment Points Various fiducial points for machine vision alignment.
H1 H2 = TiLDA Mk2 Parts:MOUNT-HOLE: MOUNTING HOLE with drill center marker
IC1 = TiLDA Mk2 Parts:ATSAM3X/A
IC2 = TiLDA Mk2 Parts:MPU-6050
IC3 = Ciseco Footprints:SRF: SRF Wireless UART Serial Data Module. www.ciseco.co.uk
IC5 = TiLDA Mk2 Parts:SPI_FLASH-X25XX: 8pin SPI Flash series x25xx. Works with devices like W25X32 and BR25L32
IC7 = TiLDA Mk2 Parts:HMC5883L: 3 Axis Digital Compass IC
IC8 = TiLDA Mk2 Parts:MCP1825T-3302E/DC: IC, Low Dropout Regulator, 3.3V, 500MA, SOT-223-5; MPN: MCP1825T-3302E/DC; OC_FARNELL: 1578410; OC_NEWARK: 40M0721; PACKAGE: SOT-223-5; SUPPLIER: Microchip
IC9 = TiLDA Mk2 Parts:V_REG_LDO: Voltage Regulator LDO Standard 150mA LDO voltage regulator in SOT-23 layout. Micrel part MIC5205. BP (by-pass) pin is used to lower output noise with 470pF cap.
IC10 = TiLDA Mk2 Parts:MCP73831: Microchip's MCP73831 Miniature single cell, fully integrated Li-Ion, Li-polymer charge management controller http://ww1.microchip.com/downloads/en/DeviceDoc/21984a.pdf
IR_RX = TiLDA Mk2 Parts:IR-RECEIVER
IR_TX = TiLDA Mk2 Parts:IR-SENDER
J1 = TiLDA Mk2 Parts:USB-AB: This is a USB AB connector that is compatible with USB OTG. i.e. this connector can serve as a host or device
J3 = TiLDA Mk2 Parts:ARDUINOSPI
J5 = TiLDA Mk2 Parts:USD-SOCKET: microSD Socket Push-push type uSD socket. Schematic element and footprint production proven. Spark Fun Electronics SKU : PRT-00127. tDoc lines correctly indicate media card edge positions when inserting (unlocked, locked, depressed).
J6 = TiLDA Mk2 Parts:POWER-POD
J7 = TiLDA Mk2 Parts:JHD12863-G13BSW-CONNECTOR
J8 JP1 JP4 JP5 = TiLDA Mk2 Parts:M02: Header 2 Standard 2-pin 0.1" header. Use with straight break away headers (SKU : PRT-00116), right angle break away headers (PRT-00553), swiss pins (PRT-00743), machine pins (PRT-00117), and female headers (PRT-00115). Molex polarized connector foot print use with SKU : PRT-08233 with associated crimp pins and housings.
JP2 = TiLDA Mk2 Parts:PINHEAD_PINHD-2X5: PIN HEADER
JP3 TP1-TP12 TP15-TP27 = TiLDA Mk2 Parts:TP: Test pad
JP6 = TiLDA Mk2 Parts:M06: Header 6 Standard 6-pin 0.1" header. Use with straight break away headers (SKU : PRT-00116), right angle break away headers (PRT-00553), swiss pins (PRT-00743), machine pins (PRT-00117), and female headers (PRT-00115). Molex polarized connector foot print use with SKU : PRT-08094 with associated crimp pins and housings. NOTES ON THE VARIANTS LOCK and LOCK_LONGPADS... This footprint was designed to help hold the alignment of a through-hole component (i.e. 6-pin header) while soldering it into place. You may notice that each hole has been shifted either up or down by 0.005 of an inch from it's more standard position (which is a perfectly straight line). This slight alteration caused the pins (the squares in the middle) to touch the edges of the holes. Because they are alternating, it causes a "brace" to hold the component in place. 0.005 has proven to be the perfect amount of "off-center" position when using our standard breakaway headers. Although looks a little odd when you look at the bare footprint, once you have a header in there, the alteration is very hard to notice. Also, if you push a header all the way into place, it is covered up entirely on the bottom side. This idea of altering the position of holes to aid alignment will be further integrated into the Sparkfun Library for other footprints. It can help hold any component with 3 or more connection pins.
JP7 = TiLDA Mk2 Parts:M08X2
JP8 = TiLDA Mk2 Parts:M04X2
JP9 = TiLDA Mk2 Parts:M01: Header 1 Standard 1-pin 0.1" header. Use with straight break away headers (SKU : PRT-00116), right angle break away headers (PRT-00553), swiss pins (PRT-00743), machine pins (PRT-00117), and female headers (PRT-00115).
L101-L103 L105 = TiLDA Mk2 Parts:WE-CBF: SMD EMI Suppression Ferrite Beads - excellent anti-EMI properties - low DCR - impedances till 3000 ohms - rated current up to 6 A
LED1 LED2 = TiLDA Mk2 Parts:LED-RGB_CLV1A-FKB: Chip LED RGB Source: http://document.sharpsma.com/files/GM1WA55311A_SS.pdf
LOGO1 = TiLDA Mk2 Parts:OSHW-LOGO: Open Source Hardware Logo This logo indicates the piece of hardware it is found on incorporates a OSHW license and/or adheres to the definition of open source hardware found here: http://freedomdefined.org/OSHW
OUTLINE1 = TiLDA Mk2 Parts:TILDA_BOARDOUTLINE
Q8 Q11 Q13 Q14 = TiLDA Mk2 Parts:MOSFET-P
Q9 Q10 Q12 = TiLDA Mk2 Parts:MOSFET-N: N-Channel Mosfet 2N7002E - 60V 260mA SOT23 [Digikey: 2N7002ET1GOSTR-ND] - REEL BSH103 - 30V 850mA SOT23 [Digikey: 568-5013-1-ND]
R4-R8 R14-R26 R31-R34 R38-R49 R102 R104-R108 = TiLDA Mk2 Parts:R-EU_: RESISTOR, European symbol
RX TX = TiLDA Mk2 Parts:LED: LEDs Standard schematic elements and footprints for 5mm, 3mm, 1206, and 0603 sized LEDs. 5mm - Spark Fun Electronics SKU : COM-00529 (and others)
S1 S4-S6 = TiLDA Mk2 Parts:TAC_SWITCH: Momentary Switch Button commonly used for reset or general input. Spark Fun Electronics SKU : COM-00097
S7 = TiLDA Mk2 Parts:JOYSTICK_MINI
S8 = TiLDA Mk2 Parts:SWITCH-SPST: SPST Switch Simple slide switch. Spark Fun Electronics SKU : COM-00102
S9 S10 = TiLDA Mk2 Parts:TAC_SWITCH1
SG1 = TiLDA Mk2 Parts:BUZZER: Buzzer 12mm Spark Fun Electronics SKU : Comp-Buzzer
SJ1 SJ2 SJ4 SJ6 SJ7 SJ9 SJ11 = TiLDA Mk2 Parts:SOLDERJUMPER: Solder Jumper Standard SMD solder jumper. Used to automate production. Two varients : Normally Open and Normally Closed are the same, but have different paste layers. NC will have a large amount of paste and should jumper during reflow.
SJ3 SJ5 SJ8 SJ10 = TiLDA Mk2 Parts:SOLDERJUMPER_2WAY: Solder Jumper 2 way solder jumper
U2 = TiLDA Mk2 Parts:JHD12864-G13BSW-OUTLINE
X1 = TiLDA Mk2 Parts:CRYSTAL
X2 = TiLDA Mk2 Parts:RESONATOR_EPSON_FC_145
Z1-Z3 = TiLDA Mk2 Parts:VARISTOR: VARISTOR

## Net classes
0 default: width 0.15 mm, drill 0.3 mm, clearance 0.15 mm
1 USB: width 0.254 mm, drill 0.4 mm, clearance 0.2 mm to class 0, clearance 0.4 mm
2 GND: width 0.3 mm, drill 0.4 mm, clearance 0.2 mm to class 0, clearance 0.2 mm
3 USBVCC: width 0.6 mm, drill 0.5 mm, clearance 0.2 mm to class 0, clearance 0.2 mm
4 ANT: width 1.27 mm, drill 0.5 mm, clearance 0.35 mm to class 0, clearance 0.35 mm to class 1, clearance 0.35 mm to class 2, clearance 0.35 mm to class 3, clearance 0.35 mm
5 CAP: width 0.15 mm, drill 0.5 mm, clearance 0.8 mm to class 0, clearance 0.8 mm to class 1, clearance 0.8 mm to class 2, clearance 0.8 mm to class 3, clearance 0.8 mm to class 4, clearance 0.8 mm